# Altium schematic sheet [2]MaxWatch.SchDoc: MaxWatch
size A4; DrawnBy: Maksym Omelchenko; Revision: v1.0; SheetNumber: 2; SheetTotal: 2
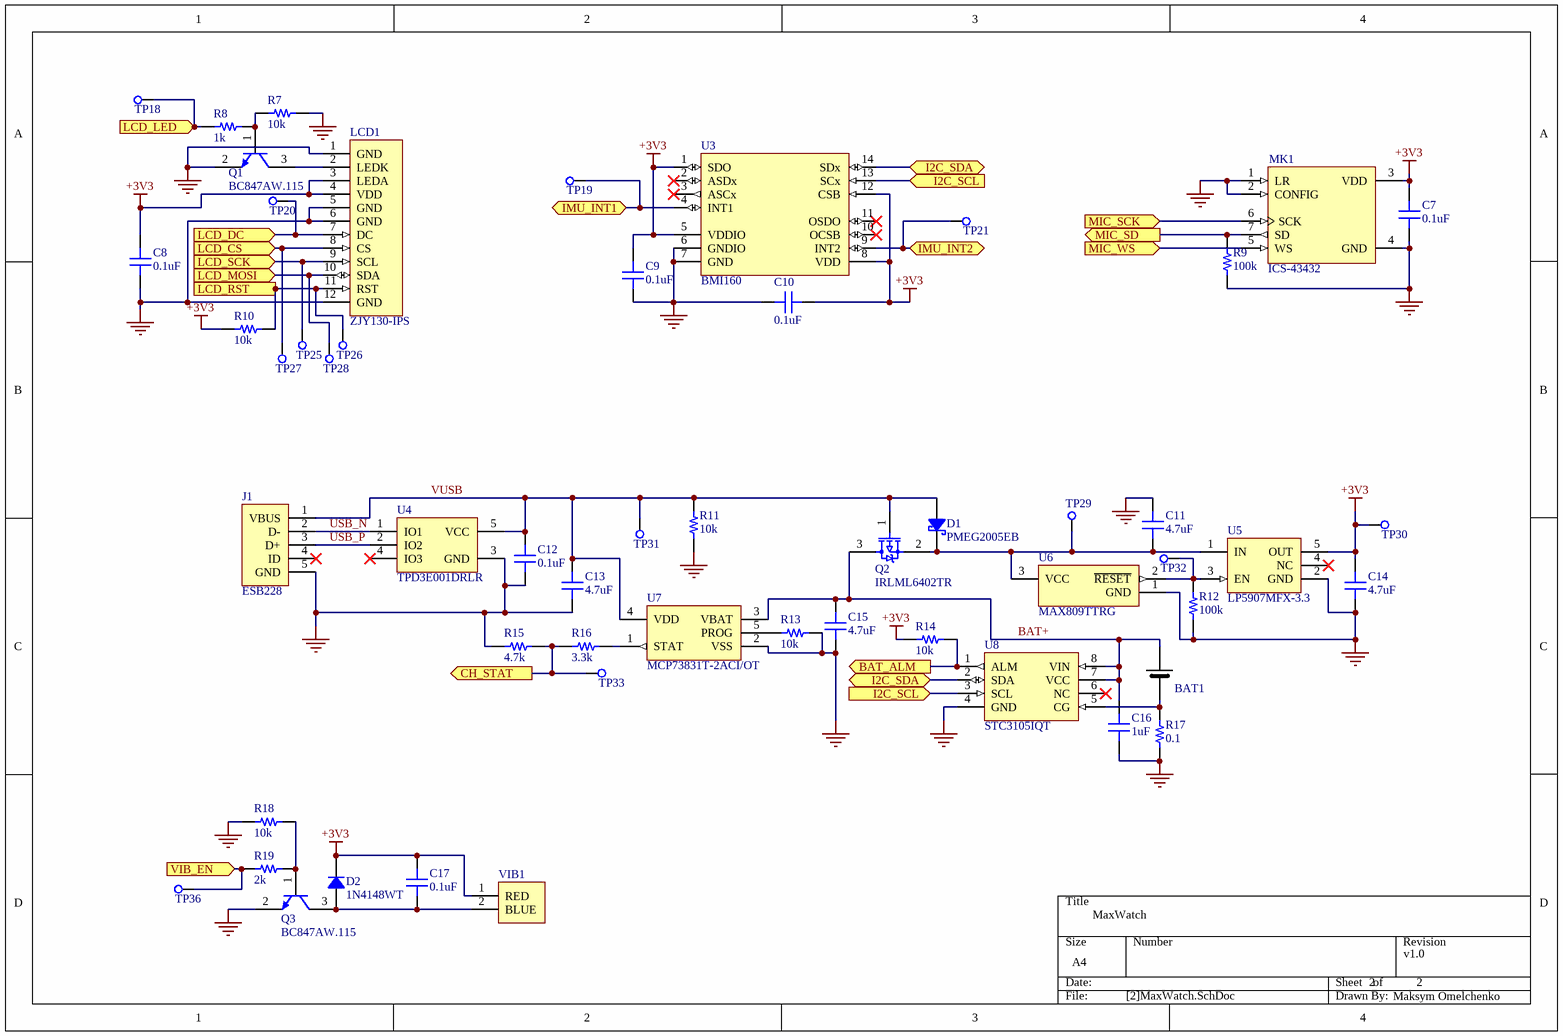
[diagram p0: [2]MaxWatch.SchDoc]

## Parts
BAT1  Lipo battery  [PCBComponent_1]  (value not drawn)
C7  0.1uF  [CAP 0402/1005]
C8  0.1uF  [CAP 0402/1005]
C9  0.1uF  [CAP 0402/1005]
C10  0.1uF  [CAP 0402/1005]
C11  4.7uF  [CAP 0603/1608]
C12  0.1uF  [CAP 0402/1005]
C13  4.7uF  [CAP 0603/1608]
C14  4.7uF  [CAP 0603/1608]
C15  4.7uF  [CAP 0603/1608]
C16  1uF  [CAP 0402/1005]
C17  0.1uF  [CAP 0402/1005]
D1  PMEG2005EB  [NXP-SOD-523F-2_V]
D2  1N4148WT  [FAIR-SOD-523F-2_V]
J1  ESB228  [EXB228]
LCD1  ZJY130-IPS ST7789 based lcd display  [ZJY130-IPS]  (value not drawn)
MK1  ICS-43432  [MIC_ICS-43432]
Q1  Model: BC847AW.115  [NEXPERIA-SC-70]  (hidden comment: BC847AW)
Q2  Model: IRLML6402TR  [Infineon_SOT23]  (hidden comment: IRLML6402TRPBF)
Q3  Model: BC847AW.115  [NEXPERIA-SC-70]  (hidden comment: BC847AW)
R7  10k  [RES 0201/0603]
R8  1k  [RES 0402/1005]
R9  100k  [RES 0402/1005]
R10  10k  [RES 0201/0603]
R11  10k  [RES 0201/0603]
R12  100k  [RES 0402/1005]
R13  10k  [RES 0201/0603]
R14  10k  [RES 0201/0603]
R15  4.7k  [RES 0402/1005]
R16  3.3k  [RES 0402/1005]
R17  0.1  [RES 0603/1608]
R18  10k  [RES 0201/0603]
R19  2k  [RES 0402/1005]
TP18  TP  [TP_0.75x0.75]  (value not drawn)
TP19  TP  [TP_0.75x0.75]  (value not drawn)
TP20  TP  [TP_0.75x0.75]  (value not drawn)
TP21  TP  [TP_0.75x0.75]  (value not drawn)
TP25  TP  [TP_0.75x0.75]  (value not drawn)
TP26  TP  [TP_0.75x0.75]  (value not drawn)
TP27  TP  [TP_0.75x0.75]  (value not drawn)
TP28  TP  [TP_0.75x0.75]  (value not drawn)
TP29  TP  [TP_0.75x0.75]  (value not drawn)
TP30  TP  [TP_0.75x0.75]  (value not drawn)
TP31  TP  [TP_0.75x0.75]  (value not drawn)
TP32  TP  [TP_0.75x0.75]  (value not drawn)
TP33  TP  [TP_0.75x0.75]  (value not drawn)
TP36  TP  [TP_0.75x0.75]  (value not drawn)
U3  BMI160  [BMI160-LGA14]
U4  TPD3E001DRLR  [DRL0005A]
U5  Model: LP5907MFX-3.3  [Texas_Instruments_DBV0005A_0]  (hidden comment: LP5907MFX-3.3-NOPB)
U6  Part Number: MAX809TTRG  [ON_Semi_CASE_318-08_0]  (hidden comment: IC_ON_Semi_MAX809TTRG)
U7  MCP73831T-2ACI/OT  [SOT-23-OT5_L]
U8  Part Number: STC3105IQT  [STMicroelectronics_STC3105IQT_0]  (hidden comment: IC_STMicroelectronics_STC3105IQT_eec)
VIB1  Vibrating Motor 0408  [Vibrating_Motor]  (value not drawn)

## Ports
BAT_ALM (out), CH_STAT (out), I2C_SCL (in), I2C_SDA (bidir), IMU_INT1 (bidir), IMU_INT2 (bidir), LCD_CS (in), LCD_DC (in), LCD_LED (in), LCD_MOSI (in), LCD_RST (in), LCD_SCK (in), MIC_SCK (in), MIC_SD (out), MIC_WS (in), VIB_EN (in)

## Nets
+3V3: C7.2 C8.2 C9.2 C10.2 C14.2 C17.2 D2.2 LCD1.3(LEDA) LCD1.4(VDD) MK1.3(VDD) R10.2 R14.2 TP30.1(TP) U3.1(SDO) U3.5(VDDIO) U3.8(VDD) U3.12(CSB) U5.5(OUT) VIB1.1(RED)
GND: C7.1 C8.1 C9.1 C10.1 C11.2 C12.1 C13.1 C14.1 C15.1 C16.1 J1.5(GND) LCD1.1(GND) LCD1.5(GND) LCD1.6(GND) LCD1.12(GND) MK1.1(LR) MK1.2(CONFIG) MK1.4(GND) Q1.2(E) Q3.2(E) R7.1 R9.1 R11.1 R12.1 R13.1 R15.2 R17.2 R18.2 U3.6(GNDIO) U3.7(GND) U4.3(GND) U5.2(GND) U6.1(GND) U7.2(VSS) U8.4(GND)
BAT+: BAT1.1 C15.2 C16.2 Q2.3(D) U7.3(VBAT) U8.7(VCC) U8.8(VIN)
BAT_ALM: R14.1 U8.1(ALM) ; port BAT_ALM
CH_STAT: R15.1 R16.1 TP33.1(TP) ; port CH_STAT
I2C_SCL: U3.13(SCx) U8.3(SCL) ; port I2C_SCL
I2C_SDA: U3.14(SDx) U8.2(SDA) ; port I2C_SDA
IMU_INT1: TP19.1(TP) U3.4(INT1) ; port IMU_INT1
IMU_INT2: TP21.1(TP) U3.9(INT2) ; port IMU_INT2
LCD_CS: LCD1.8(CS) TP27.1(TP) ; port LCD_CS
LCD_DC: LCD1.7(DC) TP20.1(TP) ; port LCD_DC
LCD_LED: R8.1 TP18.1(TP) ; port LCD_LED
LCD_MOSI: LCD1.10(SDA) TP28.1(TP) ; port LCD_MOSI
LCD_RST: LCD1.11(RST) R10.1 TP26.1(TP) ; port LCD_RST
LCD_SCK: LCD1.9(SCL) TP25.1(TP) ; port LCD_SCK
MIC_SCK: MK1.6(SCK) ; port MIC_SCK
MIC_SD: MK1.7(SD) R9.2 ; port MIC_SD
MIC_WS: MK1.5(WS) ; port MIC_WS
USB_N: J1.2(D-) U4.1(IO1)
USB_P: J1.3(D+) U4.2(IO2)
VIB_EN: R19.1 TP36.1(TP) ; port VIB_EN
VUSB: C12.2 C13.2 D1.1 J1.1(VBUS) Q2.1(G) R11.2 TP31.1(TP) U4.5(VCC) U7.4(VDD)
NetBAT1_2: BAT1.2 R17.1 U8.5(CG)
NetC11_1: C11.1 D1.2 Q2.2(S) TP29.1(TP) U5.1(IN) U6.3(VCC)
NetC17_1: C17.1 D2.1 Q3.3(C) VIB1.2(BLUE)
NetLCD1_2: LCD1.2(LEDK) Q1.3(C)
NetQ1_1: Q1.1(B) R7.2 R8.2
NetQ3_1: Q3.1(B) R18.1 R19.2
NetR12_2: R12.2 TP32.1(TP) U5.3(EN) U6.2(~{RESET})
NetR13_2: R13.2 U7.5(PROG)
NetR16_2: R16.2 U7.1(STAT)

Not connected (* = marked no-connect by the designer): J1 4(ID)*; U3 2(ASDx)* 3(ASCx)* 10(OCSB)* 11(OSDO)*; U4 4(IO3)*; U5 4(NC)*; U8 6(NC)*

## Library data of the parts
BAT1 = Lipo_battery
C7-C10 C12 C17 = C1005X7R1C104K050BC: CAP CER 0.1UF 16V X7R 0402; Manufacturer: TDK Corporation; TemperatureRange: -55C ~ 125C; Tolerance: 10%; Value: 0.1uF; Part Number: C1005X7R1C104K050BC; PartId: 3856; Supplier 1: Digi-Key; Supplier Part Number 1: 445-4952-2-ND; ComponentLink1Description: Datasheet; ComponentLink1URL: https://product.tdk.com/info/en/catalog/datasheets/mlcc_commercial_general_en.pdf; ComponentLink2Description: Digi-Key listing; ComponentLink2URL: http://digikey.com/product-detail/en/C1005X7R1C104K050BC/445-4952-2-ND/2093220; TemperatureCoefficient: X7R; Voltage: 16V; Price: 0,0066; Type: -; Device Package: 0402 (1005 Metric)
C11 C13-C15 = JMK107BJ475KA-T: CAP CER 4.7UF 6.3V X5R 0603; Manufacturer: Taiyo Yuden; TemperatureRange: -55C ~ 85C; Tolerance: 10%; Value: 4.7uF; Part Number: JMK107BJ475KA-T; PartId: 12954; Supplier 1: Digi-Key; Supplier Part Number 1: 587-1785-2-ND; ComponentLink1Description: Datasheet; ComponentLink1URL: http://ds.yuden.co.jp/TYCOMPAS/ut/detail.do?productNo=JMK107BJ475KA-T&fileName=JMK107BJ475KA-T_SS&mode=specSheetDownload; ComponentLink2Description: Digi-Key Listing; ComponentLink2URL: https://www.digikey.com/product-detail/en/taiyo-yuden/JMK107BJ475KA-T/587-1785-2-ND/1169922; TemperatureCoefficient: X5R; Voltage: 6.3V; Price: 0,0193; Device Package: 0603 (1608 Metric)
C16 = GRM155R70G105KA12D: CAP CER 1UF 4V X7R 0402; Manufacturer: Murata Electronics North America; TemperatureRange: -55C ~ 125C; Tolerance: 10%; Value: 1uF; Part Number: GRM155R70G105KA12D; PartId: 5154; Supplier 1: Digi-Key; Supplier Part Number 1: 490-7195-2-ND; ComponentLink1Description: Datasheet; ComponentLink1URL: http://www.murata.com/~/media/webrenewal/support/library/catalog/products/capacitor/mlcc/c02e.ashx; ComponentLink2Description: Digi-Key listing; ComponentLink2URL: http://digikey.com/product-detail/en/GRM155R70G105KA12D/490-7195-2-ND/3900466; TemperatureCoefficient: X7R; Voltage: 4V; Price: 0,019; Type: -; Device Package: 0402 (1005 Metric)
D1 = PMEG2005EB: Manufacturer: Nexperia; PackageReference: SOD-523F-2; HelpURL: https://assets.nexperia.com/documents/data-sheet/PMEG2005EB.pdf; Model: PMEG2005EB
D2 = 1N4148WT: High Conductance Fast Switching Diode, 75 V, -55 to 150 degC, 2-Pin SOD523F, RoHS; Manufacturer: Fairchild Semiconductor; BVR (IR: 5 uA)=75 V Min.; IR (VR: 75 V)=5 uA Max.; VF: 1 V Max.; CO: 4 pF Max.; ComponentLink1Description: Manufacturer URL; ComponentLink2Description: Datasheet; DatasheetVersion: Rev. A2; ComponentLink1URL: http://www.fairchildsemi.com/; ComponentLink2URL: http://www.fairchildsemi.com/ds/1N/1N4148WT.pdf; Temperature Range: -55 to 150 degC; Mounting Technology: Surface Mount; PackageDescription: 2-Pin Surface Mount Device, Body 1.2 x 0.8 mm, Height 0.7 mm; RoHS: TRUE; PackageReference: SOD-523F-2; PartNumber: 1N4148WT
LCD1 = ZJY130-IPS: Manufacturer: *; HelpURL: https://drive.google.com/file/d/10OsF2HCZRQybMIsUPRKqx6Sjy8L6cxdj/view; Package: *; Model: ZJY130-IPS
MK1 = ICS-43432: A high performance, low power, digital output, omnidirectional MEMS microphone with a bottom port.; MF: TDK InvenSense; SnapEDA_Link: https://www.snapeda.com/parts/ICS-43432/TDK%20InvenSense/view-part/?ref=snap; Package: LGA-7 TDK-InvenSense; HelpURL: https://www.digikey.com/product-detail/en/tdk-invensense/ICS-43432/1428-1053-1-ND/5177389; Model: ICS-43432
Q1 Q3 = BC847AW: General Purpose Transistor, NPN Silicon, 3-Pin SC70, Tape and Reel; Manufacturer: Nexperia; Polarity: NPN; ComponentLink1Description: Manufacturer URL; ComponentLink2Description: Datasheet; ComponentLink3URL: http://www.onsemi.cn/pub_link/Collateral/419-04.PDF; ComponentLink3Description: Package Specification; ComponentLink1URL: http://www.onsemi.com/; ComponentLink2URL: http://www.onsemi.cn/pub_link/Collateral/BC846AWT1-D.PDF; PackageReference: SC-70; HelpURL: https://www.digikey.com/product-detail/en/nexperia-usa-inc/BC847AW115/1727-6190-1-ND/2762688
Q2 = IRLML6402TRPBF: Manufacturer: Infineon Technologies; HelpURL: https://www.digikey.com/product-detail/en/infineon-technologies/IRLML6402TRPBF/IRLML6402PBFTR-ND/811437; Package: SOT-23
R7 R10 R11 R13 R14 R18 = RC0201JR-0710KL: RES SMD 10K OHM 5% 1/20W 0201; Manufacturer: Yageo; TemperatureRange: -55C ~ 125C; TemperatureCoefficient: 200ppm/C; PowerRating: 0.05W, 1/20W; Value: 10k; Part Number: RC0201JR-0710KL; PartId: 19453; Supplier 1: Digi-Key; Supplier Part Number 1: 311-10KNTR-ND; ComponentLink1Description: Datasheet; ComponentLink1URL: http://www.yageo.com/documents/recent/PYu-RC_Group_51_RoHS_L_04.pdf; ComponentLink2Description: Digi-Key Listing; ComponentLink2URL: https://www.digikey.com/product-detail/en/yageo/RC0201JR-0710KL/311-10KNTR-ND/1948901; Tolerance: 5%; Price: 0,0042; Device Package: 0201 (0603 Metric)
R8 = ERJ-2RKF1001X: RES SMD 1K OHM 1% 1/10W 0402; Manufacturer: Panasonic Electronic Components; TemperatureRange: -55C ~ 155C; TemperatureCoefficient: 100ppm/C; PowerRating: 0.1W, 1/10W; Value: 1k; Part Number: ERJ-2RKF1001X; PartId: 4; Supplier 1: Digi-Key; Supplier Part Number 1: P1.00KLTR-ND; ComponentLink1Description: Datasheet; ComponentLink1URL: http://industrial.panasonic.com/www-cgi/jvcr13pz.cgi?E+PZ+3+AOA0002+ERJ2RKF1001X+7+WW; ComponentLink2Description: Digikey listing; ComponentLink2URL: http://digikey.com/product-detail/en/ERJ-2RKF1001X/P1.00KLTR-ND/79729; Tolerance: 1%; Price: 0,0043; Type: Thick Film; Device Package: 0402 (1005 Metric)
R9 R12 = ERJ-2RKF1003X: RES SMD 100K OHM 1% 1/10W 0402; Manufacturer: Panasonic Electronic Components; TemperatureRange: -55C ~ 155C; TemperatureCoefficient: 100ppm/C; PowerRating: 0.1W, 1/10W; Value: 100k; Part Number: ERJ-2RKF1003X; PartId: 2; Supplier 1: Digi-Key; Supplier Part Number 1: P100KLTR-ND; ComponentLink1Description: Datasheet; ComponentLink1URL: http://industrial.panasonic.com/www-cgi/jvcr13pz.cgi?E+PZ+3+AOA0002+ERJ2RKF1003X+7+WW; ComponentLink2Description: Digikey listing; ComponentLink2URL: http://digikey.com/product-detail/en/ERJ-2RKF1003X/P100KLTR-ND/192081; Tolerance: 1%; Price: 0,0043; Type: Thick Film; Device Package: 0402 (1005 Metric)
R15 = ERJ-2RKF4701X: RES SMD 4.7K OHM 1% 1/10W 0402; Manufacturer: Panasonic Electronic Components; TemperatureRange: -55C ~ 155C; TemperatureCoefficient: 100ppm/C; PowerRating: 0.1W, 1/10W; Value: 4.7k; Part Number: ERJ-2RKF4701X; PartId: 5; Supplier 1: Digi-Key; Supplier Part Number 1: P4.70KLTR-ND; ComponentLink1Description: Datasheet; ComponentLink1URL: http://industrial.panasonic.com/www-cgi/jvcr13pz.cgi?E+PZ+3+AOA0002+ERJ2RKF4701X+7+WW; ComponentLink2Description: Digikey listing; ComponentLink2URL: http://digikey.com/product-detail/en/ERJ-2RKF4701X/P4.70KLTR-ND/1746231; Tolerance: 1%; Price: 0,0043; Type: Thick Film; Device Package: 0402 (1005 Metric)
R16 = ERJ-2RKF3301X: RES SMD 3.3K OHM 1% 1/10W 0402; Manufacturer: Panasonic Electronic Components; TemperatureRange: -55C ~ 155C; TemperatureCoefficient: 100ppm/C; PowerRating: 0.1W, 1/10W; Value: 3.3k; Part Number: ERJ-2RKF3301X; PartId: 159; Supplier 1: Digi-Key; Supplier Part Number 1: P3.30KLTR-ND; ComponentLink1Description: Datasheet; ComponentLink1URL: http://industrial.panasonic.com/www-cgi/jvcr13pz.cgi?E+PZ+3+AOA0002+ERJ2RKF3301X+7+WW; ComponentLink2Description: Digikey listing; ComponentLink2URL: http://digikey.com/product-detail/en/ERJ-2RKF3301X/P3.30KLTR-ND/1746191; Tolerance: 1%; Price: 0,0043; Type: Thick Film; Device Package: 0402 (1005 Metric)
R17 = ERJ-3RSFR10V: RES SMD 0.1 OHM 1% 1/10W 0603; Manufacturer: Panasonic Electronic Components; TemperatureRange: -55C ~ 125C; TemperatureCoefficient: 300ppm/C; PowerRating: 0.1W, 1/10W; Value: 0.1; Part Number: ERJ-3RSFR10V; PartId: 1431; Supplier 1: Digi-Key; Supplier Part Number 1: P.10AJTR-ND; ComponentLink1Description: Datasheet; ComponentLink1URL: http://industrial.panasonic.com/lecs/www-data/pdf/AOA0000/AOA0000CE3.pdf; ComponentLink2Description: Digi-Key listing; ComponentLink2URL: http://digikey.com/product-detail/en/ERJ-3RSFR10V/P.10AJTR-ND/308050; Tolerance: 1%; Price: 0,0497; Type: Thick Film; Device Package: 0603 (1608 Metric)
R19 = ERJ-2RKF2001X: RES SMD 2K OHM 1% 1/10W 0402; Manufacturer: Panasonic Electronic Components; TemperatureRange: -55C ~ 155C; TemperatureCoefficient: 100ppm/C; PowerRating: 0.1W, 1/10W; Value: 2k; Part Number: ERJ-2RKF2001X; PartId: 16; Supplier 1: Digi-Key; Supplier Part Number 1: P2.00KLTR-ND; ComponentLink1Description: Datasheet; ComponentLink1URL: http://industrial.panasonic.com/www-cgi/jvcr13pz.cgi?E+PZ+3+AOA0002+ERJ2RKF2001X+7+WW; ComponentLink2Description: Digikey listing; ComponentLink2URL: http://digikey.com/product-detail/en/ERJ-2RKF2001X/P2.00KLTR-ND/192194; Tolerance: 1%; Price: 0,0043; Type: Thick Film; Device Package: 0402 (1005 Metric)
U4 = TPD3E001DRLR: Low-Capacitance + / - 15 kV ESD-Protection Array for High-Speed Data Interfaces, 3 Channels, -40 to +85 degC, 5-pin SOT (DRL), Green (RoHS & no Sb/Br); Manufacturer: Texas Instruments; IO Capacitance(Typ)(pF): 1.5; IEC 61000-4-2 Contact(+/- kV): 8; USB High Speed: TRUE; Breakdown Voltage(Min)(V): 11; IO Leakage Current(nA): 1; IEC 61000-4-2 Air-Gap(+/- kV): 15; SubFamily: ESD Solution; ComponentLink1Description: Manufacturer URL; ComponentLink2Description: Datasheet; DatasheetVersion: SLLS683D; ComponentLink1URL: http://www.ti.com/; PackageReference: DRL0005A; Mounting Technology: Surface Mount; PackageVersion: revD, Aug-2007; Eco-Plan: Green (RoHS & no Sb/Br); PackageDescription: 5-Pin Plastic Small Outline, Flat Lead 0.5 mm Pitch; ComponentLink2URL: http://www.ti.com/general/docs/lit/getliterature.tsp?genericPartNumber=TPD3E001&fileType=pdf; HelpURL: https://www.digikey.com/product-detail/en/texas-instruments/TPD3E001DRLR/296-21885-2-ND/1629059; PartNumber: TPD3E001DRLR
U5 = LP5907MFX-3.3-NOPB: Manufacturer: Texas Instruments; HelpURL: https://www.digikey.com/product-detail/en/texas-instruments/LP5907MFX-3.3-NOPB/296-38557-1-ND/5034443; Package: SOT-23
U6 = IC_ON_Semi_MAX809TTRG: IC MPU SUPERVISORY 3.08V SOT23; Manufacturer: ON Semi; helpURL: https://www.digikey.no/product-detail/en/on-semiconductor/MAX809TTRG/MAX809TTRGOSCT-ND/917961; ComponentLink2Description: Datasheet; Temperature: -40°C to +105°C; Package: CASE 318−08; ComponentLink2URL: http://www.onsemi.com/pub/Collateral/MAX809S-D.PDF; RoHS: TRUE; Temperature Range High: +105°C; Digikey Description: IC MPU SUPERVISORY 3.08V SOT23; Lead Free: yes; Temperature Range Low: -40°C
U7 = MCP73831T-2ACI/OT: Miniature Single-Cell, Fully Integrated Li-Ion, Li-Polymer Charge Management Controller, 4.2V, 5-Pin SOT-23, Industrial Temperature, Tape and Reel; PackageDescription: 5-Lead Plastic Small Outline Transistor (OT) [SOT-23]; PackageVersion: revBB, Aug-2009; PackageReference: SOT-23-OT5; Code_IPC: SOT23-5; HelpURL: https://www.digikey.com/product-detail/en/microchip-technology/MCP73831T-2ACI-OT/MCP73831T-2ACI-OTCT-ND/1979802; Model: MCP73831T-2ACI/OT
U8 = IC_STMicroelectronics_STC3105IQT_eec: IC Battery Battery Monitor IC 8-TDFN (3x2); Voltage: 2.7V~5.5V; helpURL: https://upverter.com/upn/revision/8494118aa069985d/; ComponentLink2Description: Datasheet; Temperature: -40°C to +85°C; Package: TDFN8; Supplier 2: Mouser; Price: 1.15591491198; Supplier 1: Digi-Key; ComponentLink1URL: https://upverter.com/upn/revision/8494118aa069985d/; Supplier Part Number 2: 511-STC3105IQT; Supplier Part Number 1: 497-12092-1-ND; Manufacturer: STMicroelectronics; ComponentLink1Description: Upverter; ComponentLink2URL: https://upverter.com/datasheet/b682a1d550b556c65fc34921f7bde641791c228d.pdf; RoHS: TRUE; Mouser Part Number: 511-STC3105IQT; Ipc Land Pattern Name: DFN300X200X75-8; Temperature Range High: +85°C; Digikey Description: IC Battery Battery Monitor IC 8-TDFN (3x2); Digikey Part Number: 497-12092-1-ND; Lead Free: yes; Temperature Range Low: -40°C
VIB1 = Vibrating Motor: Package: 0408
J1 = ESB228: Type: MicroUSB; Termination Method: Solder; Manufacturer: *; HelpURL: http://www.ges.cz/sheets/6/6615670.pdf; Model: ESB228